# Altium schematic sheet FPGA_Banks_67_68.SchDoc: =ProjectName
size 420 x 297 mm; Author: T.P.; CompanyName: WUT; DrawnBy: T.P.; Organization: WUT ISE; Address1: Warsaw Univeristy of Technology; Address2: Nowowiejska 15/19; DocumentNumber: 9; Revision: 0.9; SheetNumber: 9; SheetTotal: 36; EDA_Number: ARTIQ; Projet: ARTIQ/SINARA; ModifiedBy: -; CreateDate: XX/XX/XXXX; CheckedDate: -; Title2: FPGA_Banks_67_68.SchDoc; DivGrp: ISE; Designer: G.K. and T.P.; ModifiedDate: -; ProjectName: ADC/DAC MEZZANINE
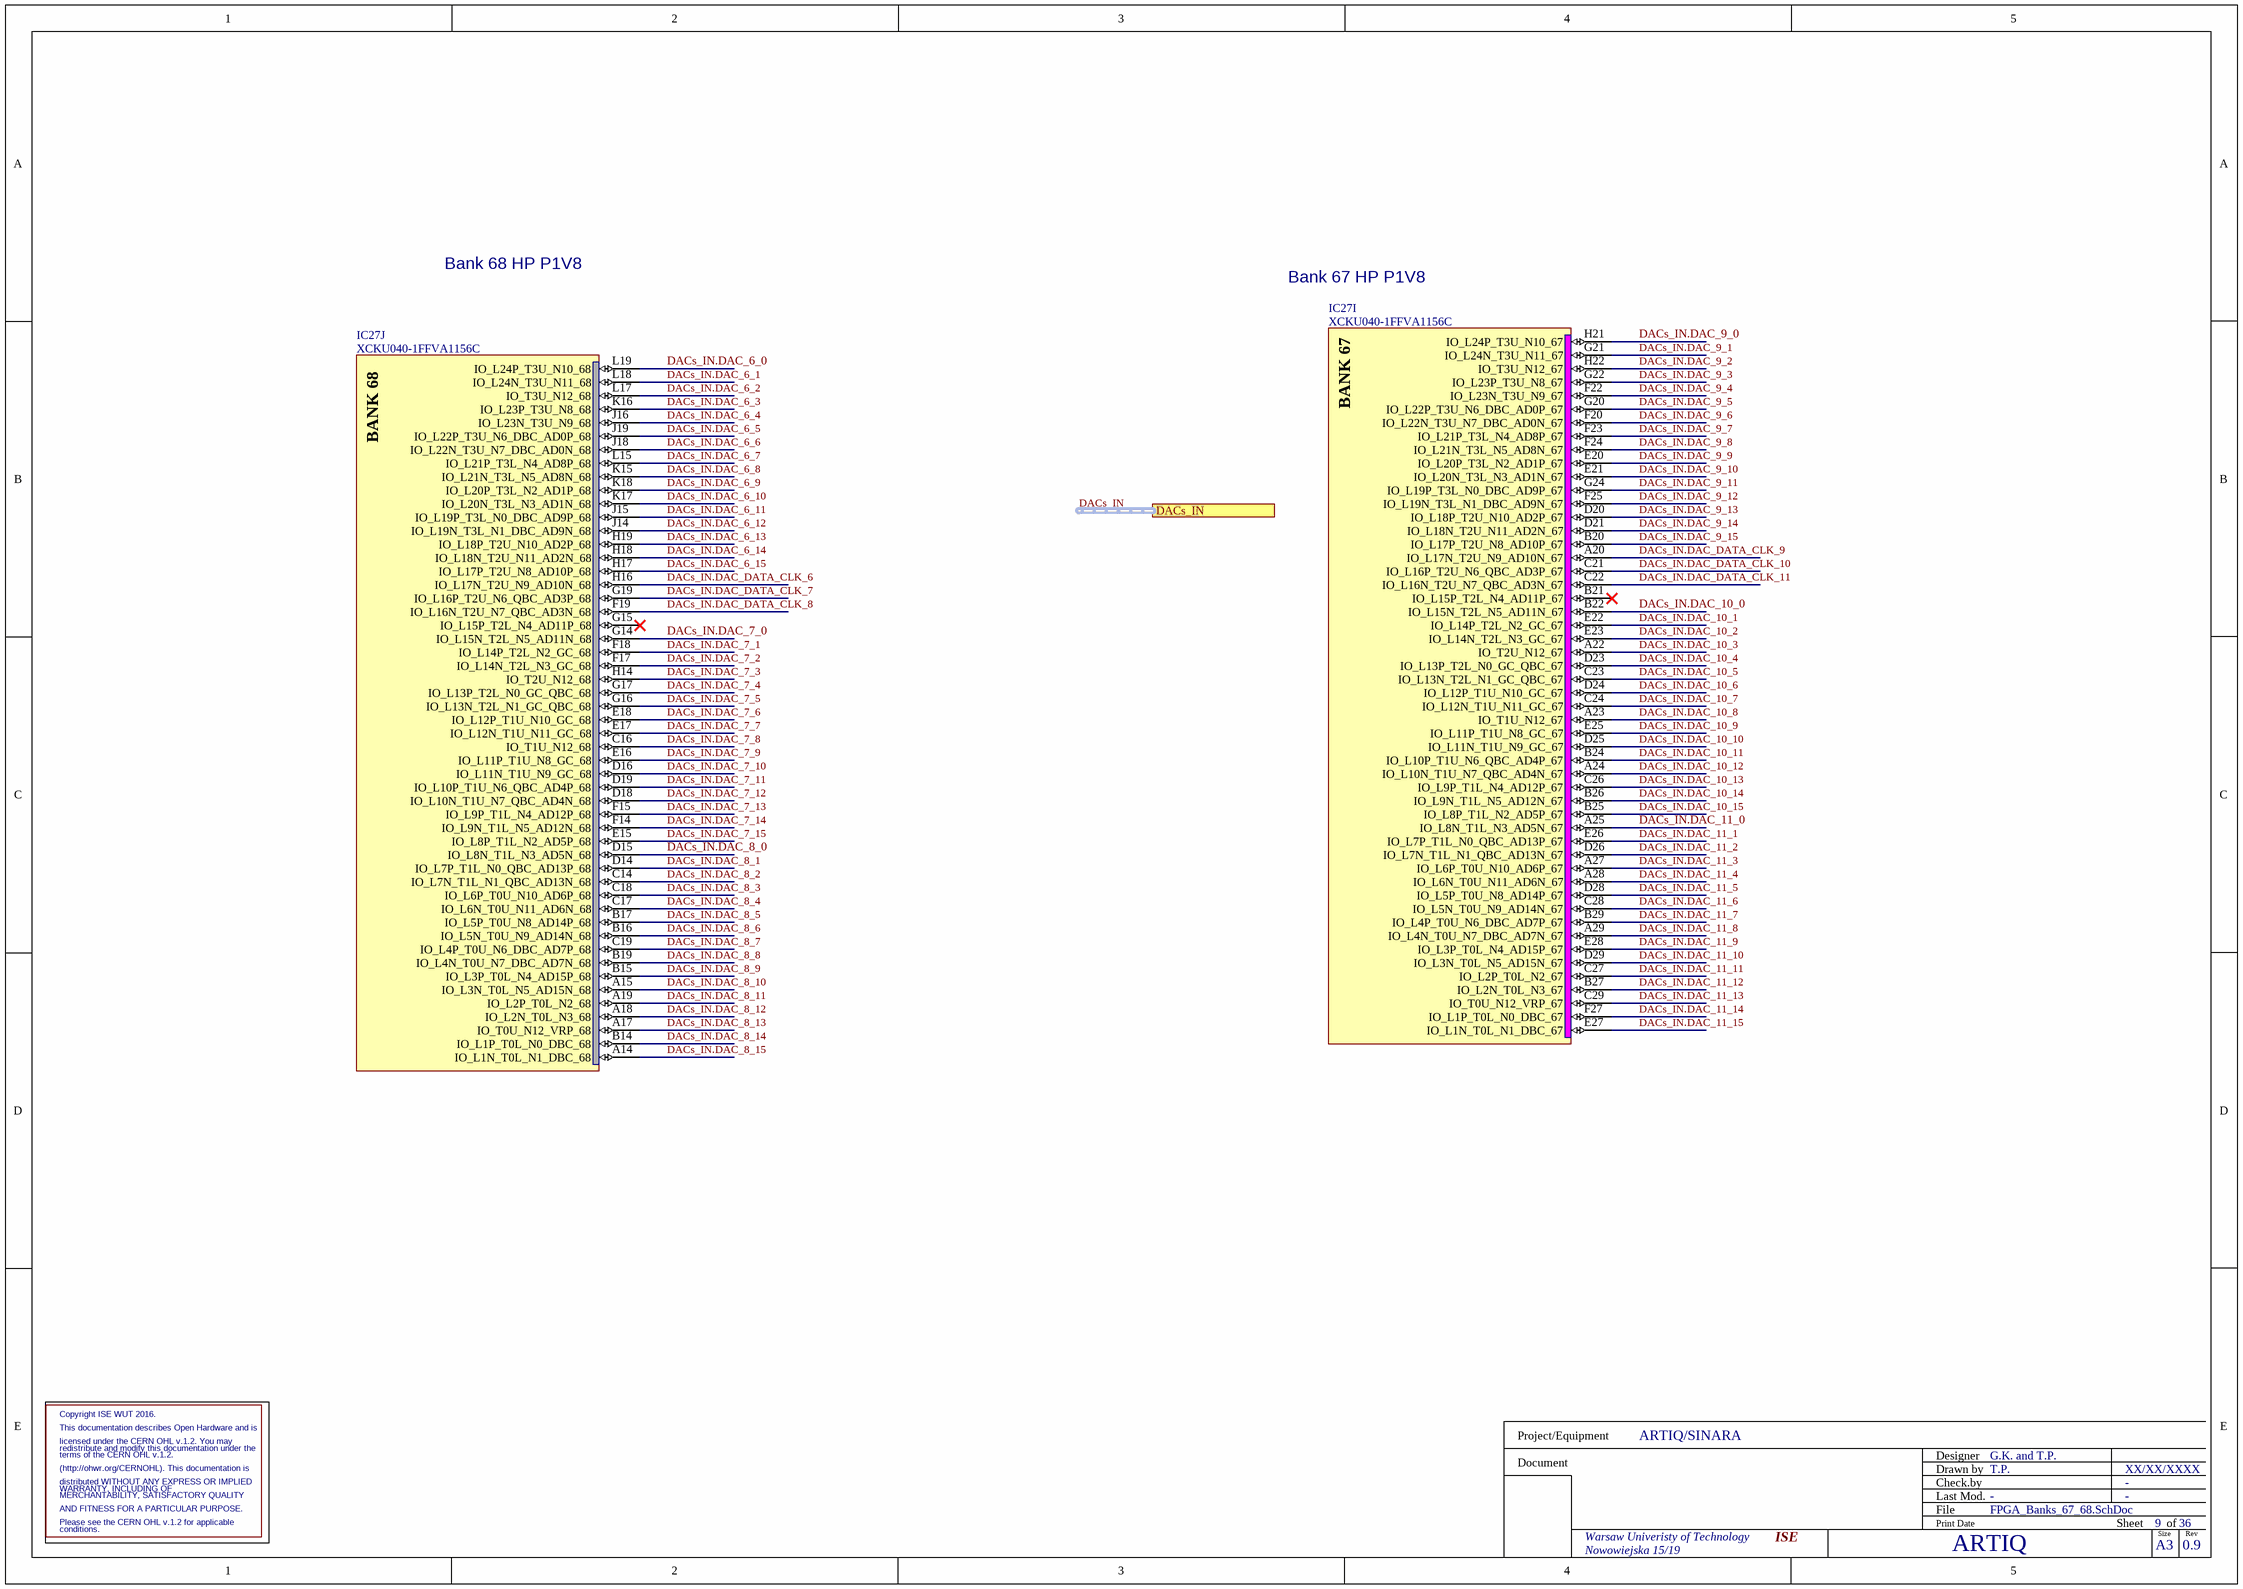
[diagram p0: FPGA_Banks_67_68.SchDoc]

## Parts
IC27  XCKU040-1FFVA1156C  [BGA1156C100P34X34_3500X3500X350]  (parts I,J of 22)

## Ports
DACs_IN (harness DAC_IN)

## Nets
DACs_IN.DAC_6_0: IC27.L19(IO_L24P_T3U_N10_68)
DACs_IN.DAC_6_1: IC27.L18(IO_L24N_T3U_N11_68)
DACs_IN.DAC_6_2: IC27.L17(IO_T3U_N12_68)
DACs_IN.DAC_6_3: IC27.K16(IO_L23P_T3U_N8_68)
DACs_IN.DAC_6_4: IC27.J16(IO_L23N_T3U_N9_68)
DACs_IN.DAC_6_5: IC27.J19(IO_L22P_T3U_N6_DBC_AD0P_68)
DACs_IN.DAC_6_6: IC27.J18(IO_L22N_T3U_N7_DBC_AD0N_68)
DACs_IN.DAC_6_7: IC27.L15(IO_L21P_T3L_N4_AD8P_68)
DACs_IN.DAC_6_8: IC27.K15(IO_L21N_T3L_N5_AD8N_68)
DACs_IN.DAC_6_9: IC27.K18(IO_L20P_T3L_N2_AD1P_68)
DACs_IN.DAC_6_10: IC27.K17(IO_L20N_T3L_N3_AD1N_68)
DACs_IN.DAC_6_11: IC27.J15(IO_L19P_T3L_N0_DBC_AD9P_68)
DACs_IN.DAC_6_12: IC27.J14(IO_L19N_T3L_N1_DBC_AD9N_68)
DACs_IN.DAC_6_13: IC27.H19(IO_L18P_T2U_N10_AD2P_68)
DACs_IN.DAC_6_14: IC27.H18(IO_L18N_T2U_N11_AD2N_68)
DACs_IN.DAC_6_15: IC27.H17(IO_L17P_T2U_N8_AD10P_68)
DACs_IN.DAC_7_0: IC27.G14(IO_L15N_T2L_N5_AD11N_68)
DACs_IN.DAC_7_1: IC27.F18(IO_L14P_T2L_N2_GC_68)
DACs_IN.DAC_7_2: IC27.F17(IO_L14N_T2L_N3_GC_68)
DACs_IN.DAC_7_3: IC27.H14(IO_T2U_N12_68)
DACs_IN.DAC_7_4: IC27.G17(IO_L13P_T2L_N0_GC_QBC_68)
DACs_IN.DAC_7_5: IC27.G16(IO_L13N_T2L_N1_GC_QBC_68)
DACs_IN.DAC_7_6: IC27.E18(IO_L12P_T1U_N10_GC_68)
DACs_IN.DAC_7_7: IC27.E17(IO_L12N_T1U_N11_GC_68)
DACs_IN.DAC_7_8: IC27.C16(IO_T1U_N12_68)
DACs_IN.DAC_7_9: IC27.E16(IO_L11P_T1U_N8_GC_68)
DACs_IN.DAC_7_10: IC27.D16(IO_L11N_T1U_N9_GC_68)
DACs_IN.DAC_7_11: IC27.D19(IO_L10P_T1U_N6_QBC_AD4P_68)
DACs_IN.DAC_7_12: IC27.D18(IO_L10N_T1U_N7_QBC_AD4N_68)
DACs_IN.DAC_7_13: IC27.F15(IO_L9P_T1L_N4_AD12P_68)
DACs_IN.DAC_7_14: IC27.F14(IO_L9N_T1L_N5_AD12N_68)
DACs_IN.DAC_7_15: IC27.E15(IO_L8P_T1L_N2_AD5P_68)
DACs_IN.DAC_8_0: IC27.D15(IO_L8N_T1L_N3_AD5N_68)
DACs_IN.DAC_8_1: IC27.D14(IO_L7P_T1L_N0_QBC_AD13P_68)
DACs_IN.DAC_8_2: IC27.C14(IO_L7N_T1L_N1_QBC_AD13N_68)
DACs_IN.DAC_8_3: IC27.C18(IO_L6P_T0U_N10_AD6P_68)
DACs_IN.DAC_8_4: IC27.C17(IO_L6N_T0U_N11_AD6N_68)
DACs_IN.DAC_8_5: IC27.B17(IO_L5P_T0U_N8_AD14P_68)
DACs_IN.DAC_8_6: IC27.B16(IO_L5N_T0U_N9_AD14N_68)
DACs_IN.DAC_8_7: IC27.C19(IO_L4P_T0U_N6_DBC_AD7P_68)
DACs_IN.DAC_8_8: IC27.B19(IO_L4N_T0U_N7_DBC_AD7N_68)
DACs_IN.DAC_8_9: IC27.B15(IO_L3P_T0L_N4_AD15P_68)
DACs_IN.DAC_8_10: IC27.A15(IO_L3N_T0L_N5_AD15N_68)
DACs_IN.DAC_8_11: IC27.A19(IO_L2P_T0L_N2_68)
DACs_IN.DAC_8_12: IC27.A18(IO_L2N_T0L_N3_68)
DACs_IN.DAC_8_13: IC27.A17(IO_T0U_N12_VRP_68)
DACs_IN.DAC_8_14: IC27.B14(IO_L1P_T0L_N0_DBC_68)
DACs_IN.DAC_8_15: IC27.A14(IO_L1N_T0L_N1_DBC_68)
DACs_IN.DAC_9_0: IC27.H21(IO_L24P_T3U_N10_67)
DACs_IN.DAC_9_1: IC27.G21(IO_L24N_T3U_N11_67)
DACs_IN.DAC_9_2: IC27.H22(IO_T3U_N12_67)
DACs_IN.DAC_9_3: IC27.G22(IO_L23P_T3U_N8_67)
DACs_IN.DAC_9_4: IC27.F22(IO_L23N_T3U_N9_67)
DACs_IN.DAC_9_5: IC27.G20(IO_L22P_T3U_N6_DBC_AD0P_67)
DACs_IN.DAC_9_6: IC27.F20(IO_L22N_T3U_N7_DBC_AD0N_67)
DACs_IN.DAC_9_7: IC27.F23(IO_L21P_T3L_N4_AD8P_67)
DACs_IN.DAC_9_8: IC27.F24(IO_L21N_T3L_N5_AD8N_67)
DACs_IN.DAC_9_9: IC27.E20(IO_L20P_T3L_N2_AD1P_67)
DACs_IN.DAC_9_10: IC27.E21(IO_L20N_T3L_N3_AD1N_67)
DACs_IN.DAC_9_11: IC27.G24(IO_L19P_T3L_N0_DBC_AD9P_67)
DACs_IN.DAC_9_12: IC27.F25(IO_L19N_T3L_N1_DBC_AD9N_67)
DACs_IN.DAC_9_13: IC27.D20(IO_L18P_T2U_N10_AD2P_67)
DACs_IN.DAC_9_14: IC27.D21(IO_L18N_T2U_N11_AD2N_67)
DACs_IN.DAC_9_15: IC27.B20(IO_L17P_T2U_N8_AD10P_67)
DACs_IN.DAC_10_0: IC27.B22(IO_L15N_T2L_N5_AD11N_67)
DACs_IN.DAC_10_1: IC27.E22(IO_L14P_T2L_N2_GC_67)
DACs_IN.DAC_10_2: IC27.E23(IO_L14N_T2L_N3_GC_67)
DACs_IN.DAC_10_3: IC27.A22(IO_T2U_N12_67)
DACs_IN.DAC_10_4: IC27.D23(IO_L13P_T2L_N0_GC_QBC_67)
DACs_IN.DAC_10_5: IC27.C23(IO_L13N_T2L_N1_GC_QBC_67)
DACs_IN.DAC_10_6: IC27.D24(IO_L12P_T1U_N10_GC_67)
DACs_IN.DAC_10_7: IC27.C24(IO_L12N_T1U_N11_GC_67)
DACs_IN.DAC_10_8: IC27.A23(IO_T1U_N12_67)
DACs_IN.DAC_10_9: IC27.E25(IO_L11P_T1U_N8_GC_67)
DACs_IN.DAC_10_10: IC27.D25(IO_L11N_T1U_N9_GC_67)
DACs_IN.DAC_10_11: IC27.B24(IO_L10P_T1U_N6_QBC_AD4P_67)
DACs_IN.DAC_10_12: IC27.A24(IO_L10N_T1U_N7_QBC_AD4N_67)
DACs_IN.DAC_10_13: IC27.C26(IO_L9P_T1L_N4_AD12P_67)
DACs_IN.DAC_10_14: IC27.B26(IO_L9N_T1L_N5_AD12N_67)
DACs_IN.DAC_10_15: IC27.B25(IO_L8P_T1L_N2_AD5P_67)
DACs_IN.DAC_11_0: IC27.A25(IO_L8N_T1L_N3_AD5N_67)
DACs_IN.DAC_11_1: IC27.E26(IO_L7P_T1L_N0_QBC_AD13P_67)
DACs_IN.DAC_11_2: IC27.D26(IO_L7N_T1L_N1_QBC_AD13N_67)
DACs_IN.DAC_11_3: IC27.A27(IO_L6P_T0U_N10_AD6P_67)
DACs_IN.DAC_11_4: IC27.A28(IO_L6N_T0U_N11_AD6N_67)
DACs_IN.DAC_11_5: IC27.D28(IO_L5P_T0U_N8_AD14P_67)
DACs_IN.DAC_11_6: IC27.C28(IO_L5N_T0U_N9_AD14N_67)
DACs_IN.DAC_11_7: IC27.B29(IO_L4P_T0U_N6_DBC_AD7P_67)
DACs_IN.DAC_11_8: IC27.A29(IO_L4N_T0U_N7_DBC_AD7N_67)
DACs_IN.DAC_11_9: IC27.E28(IO_L3P_T0L_N4_AD15P_67)
DACs_IN.DAC_11_10: IC27.D29(IO_L3N_T0L_N5_AD15N_67)
DACs_IN.DAC_11_11: IC27.C27(IO_L2P_T0L_N2_67)
DACs_IN.DAC_11_12: IC27.B27(IO_L2N_T0L_N3_67)
DACs_IN.DAC_11_13: IC27.C29(IO_T0U_N12_VRP_67)
DACs_IN.DAC_11_14: IC27.F27(IO_L1P_T0L_N0_DBC_67)
DACs_IN.DAC_11_15: IC27.E27(IO_L1N_T0L_N1_DBC_67)
DACs_IN.DAC_DATA_CLK_6: IC27.H16(IO_L17N_T2U_N9_AD10N_68)
DACs_IN.DAC_DATA_CLK_7: IC27.G19(IO_L16P_T2U_N6_QBC_AD3P_68)
DACs_IN.DAC_DATA_CLK_8: IC27.F19(IO_L16N_T2U_N7_QBC_AD3N_68)
DACs_IN.DAC_DATA_CLK_9: IC27.A20(IO_L17N_T2U_N9_AD10N_67)
DACs_IN.DAC_DATA_CLK_10: IC27.C21(IO_L16P_T2U_N6_QBC_AD3P_67)
DACs_IN.DAC_DATA_CLK_11: IC27.C22(IO_L16N_T2U_N7_QBC_AD3N_67)

Not connected (* = marked no-connect by the designer): IC27 B21(IO_L15P_T2L_N4_AD11P_67)* G15(IO_L15P_T2L_N4_AD11P_68)*

## Buses and harness runs
harness DACs_IN = port DACs_IN

## Notes on the sheet
- Bank 68 HP P1V8
- Bank 67 HP P1V8
- Copyright ISE WUT 2016.
- This documentation describes Open Hardware and is
- licensed under the CERN OHL v.1.2. You may
- (http://ohwr.org/CERNOHL). This documentation is
- WARRANTY, INCLUDING OF
- terms of the CERN OHL v.1.2.
- distributed WITHOUT ANY EXPRESS OR IMPLIED
- redistribute and modify this documentation under the
- conditions.
- AND FITNESS FOR A PARTICULAR PURPOSE.
- Please see the CERN OHL v.1.2 for applicable
- MERCHANTABILITY, SATISFACTORY QUALITY
- Project/Equipment
- Document
- Designer
- Drawn by
- Check.by
- File
- Last Mod.
- Print Date
- Sheet
- Size
- A3
- of
- Rev
- (in symbol XCKU040-1FFVA1156C, part I) BANK 67
- (in symbol XCKU040-1FFVA1156C, part J) BANK 68

## Library data of the parts
IC27 = XCKU040-1FFVA1156C: Kintex UltraScale FPGA, 520 I/O, 530K Cells, 1156-Ball BGA, Speed Grade 1, Commercial Grade; Manufacturer: XILINX; Part Description: Kintex UltraScale, 40 DLL I/O, 416 HP I/O, 104 HR I/O, 1156-Pin BGA, Speed Grade 1, Commercial Grade; PressFit: No; Bonding: No; Manufacturer Part Number: XCKU040-1FFVA1156C; PackageDescription: BGA, 1.00mm Pitch, Square; 1156 Pin, 34 Columns X 34 Rows, Body 35.00mm X 35.00mm X 3.50mm H, IPC Medium Density; Part Number: XCKU040-1FFVA1156C; Component Kind: Standard; Component Type: Standard; Device: XCKU040-1FFVA1156C; Pin Count: 1156; Case: BGA1156; Mounted: Yes; Socket: No; SMD: Yes; Sense: No; ComponentHeight: 3.5mm; HelpURL: \\cern.ch\dfs\Applications\Altium\Datasheets\XCKU040-1FFVA1156C.pdf; ComponentLink1URL: \\cern.ch\dfs\Applications\Altium\Datasheets\XCKU040-1FFVA1156C_Package-Pinout.pdf; ComponentLink1Description: Package/Pinout; Author: CERN DEM CA; CreateDate: 16.08.2016; LatestRevisionDate: 16.08.2016